# EAGLE design hybrid_esc (EAGLE 7.6.0)
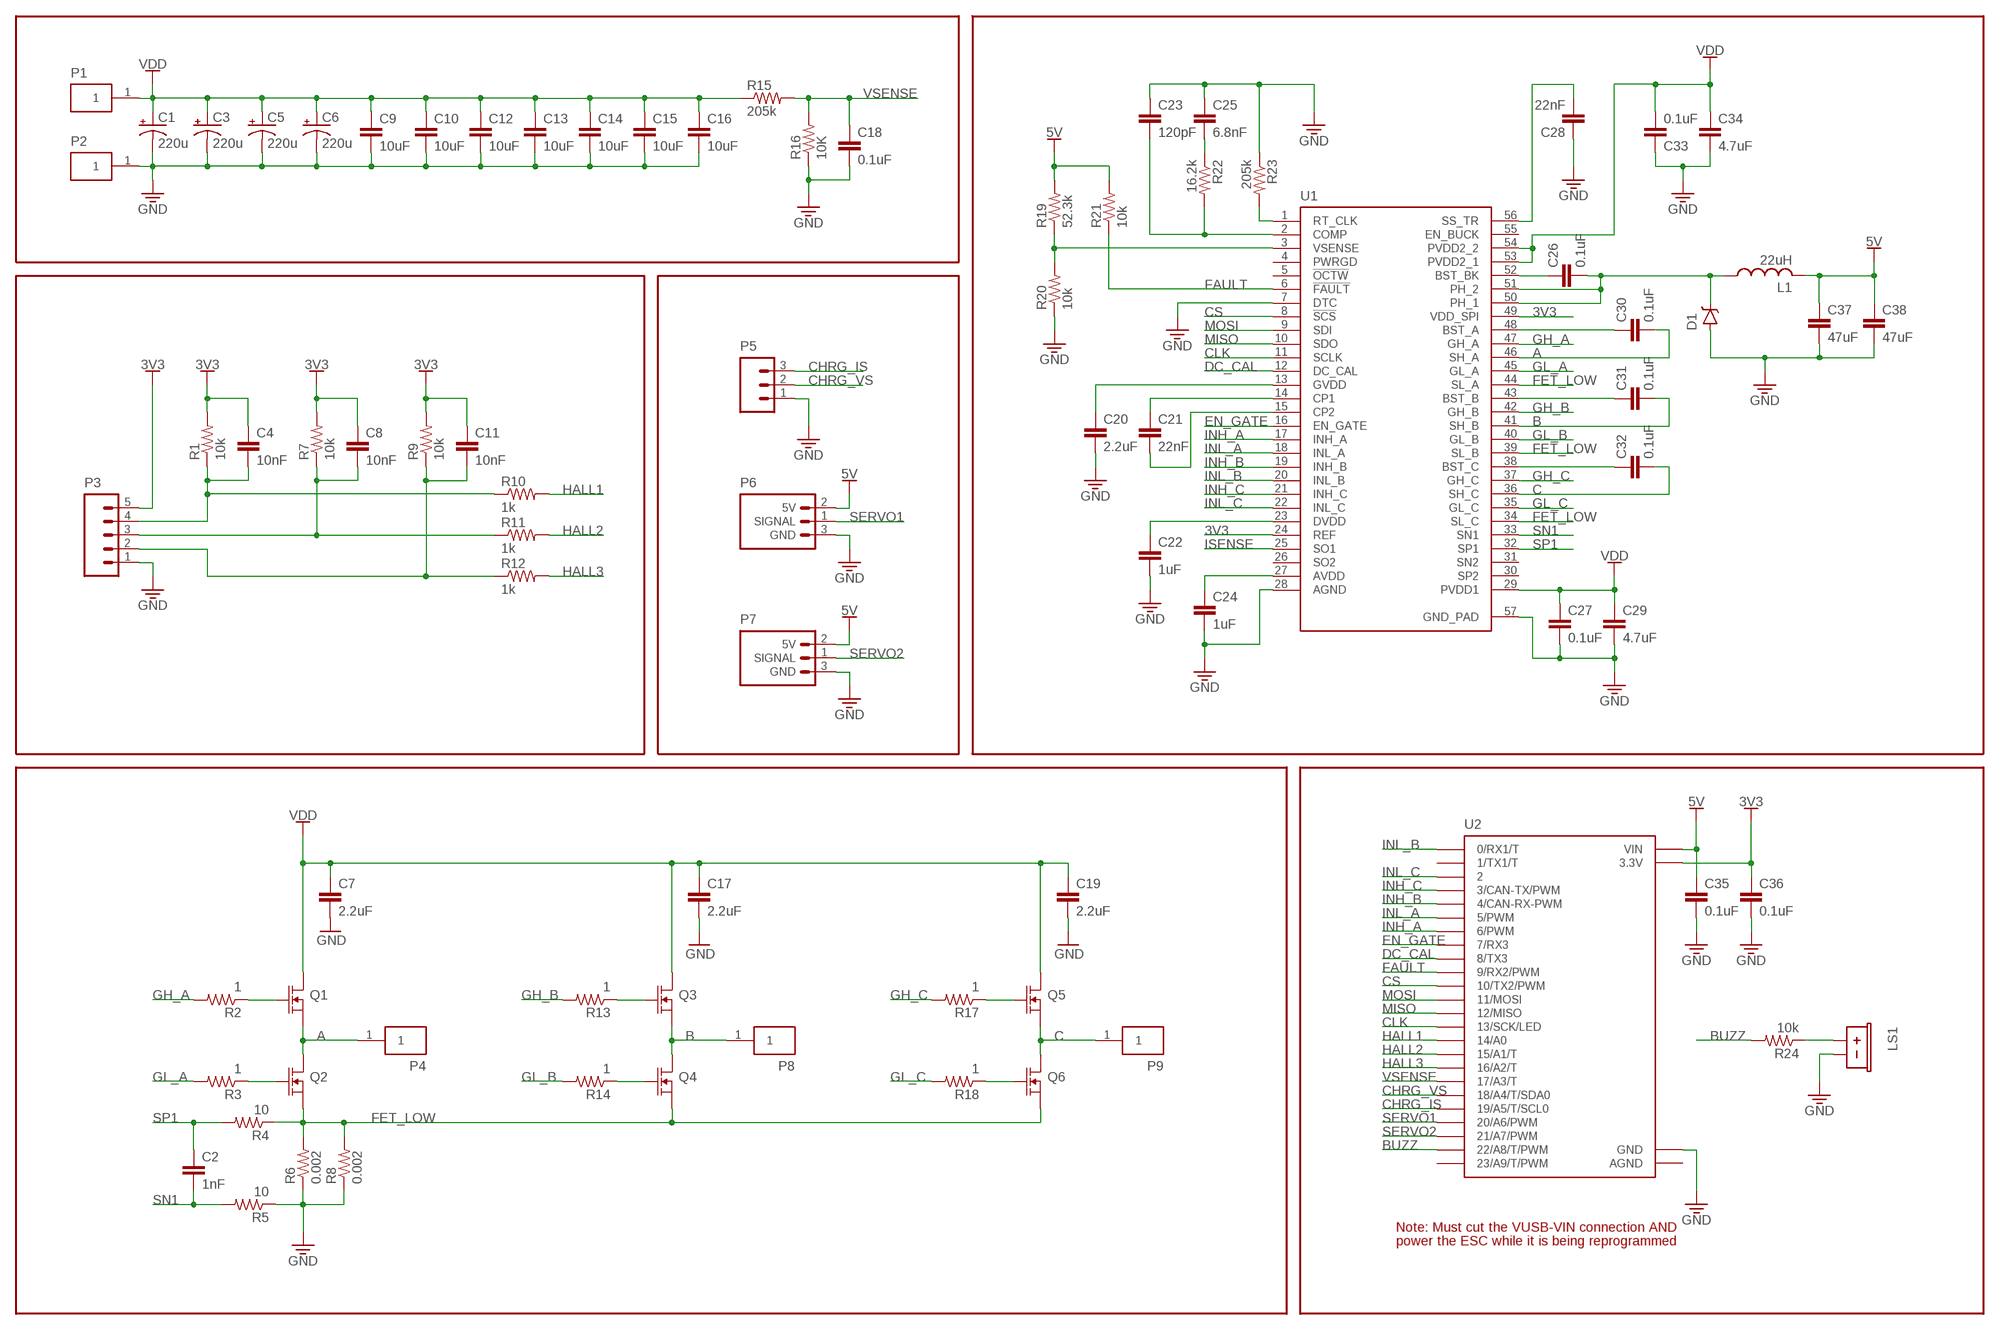
[diagram p0: schematic, sheet 1]

## Parts
C1  220u  CPOL_10_5  [CPOL_10_5]
C2  1nF  C0603  [C0603]
C3  220u  CPOL_10_5  [CPOL_10_5]
C4  10nF  C0603  [C0603]
C5  220u  CPOL_10_5  [CPOL_10_5]
C6  220u  CPOL_10_5  [CPOL_10_5]
C7  2.2uF  C1206  [C1206]
C8  10nF  C0603  [C0603]
C9  10uF  C1206  [C1206]
C10  10uF  C1206  [C1206]
C11  10nF  C0603  [C0603]
C12  10uF  C1206  [C1206]
C13  10uF  C1206  [C1206]
C14  10uF  C1206  [C1206]
C15  10uF  C1206  [C1206]
C16  10uF  C1206  [C1206]
C17  2.2uF  C1206  [C1206]
C18  0.1uF  C0603  [C0603]
C19  2.2uF  C1206  [C1206]
C20  2.2uF  C0603  [C0603]
C21  22nF  C0603  [C0603]
C22  1uF  C0603  [C0603]
C23  120pF  C0603  [C0603]
C24  1uF  C0603  [C0603]
C25  6.8nF  C0603  [C0603]
C26  0.1uF  C0603  [C0603]
C27  0.1uF  C0603  [C0603]
C28  22nF  C0603  [C0603]
C29  4.7uF  C1206  [C1206]
C30  0.1uF  C0603  [C0603]
C31  0.1uF  C0603  [C0603]
C32  0.1uF  C0603  [C0603]
C33  0.1uF  C0603  [C0603]
C34  4.7uF  C1206  [C1206]
C35  0.1uF  C0603  [C0603]
C36  0.1uF  C0603  [C0603]
C37  47uF  C1206  [C1206]
C38  47uF  C1206  [C1206]
D1  D_SOD123W  [SOD123W]
L1  22uH  L_SDR0805  [SDR0805]
LS1  BUZZER_12MM  [BUZZER_12MM]
P1  POWER_PAD  [POWER_PAD]
P2  POWER_PAD  [POWER_PAD]
P3  JST-XH5  [JST-XH5]
P4  POWER_PAD  [POWER_PAD]
P5  CONN_03  [CONN_03]
P6  SERVO  [SERVO]
P7  SERVO  [SERVO]
P8  POWER_PAD  [POWER_PAD]
P9  POWER_PAD  [POWER_PAD]
Q1  NFET_D2PAK-7  [D2PAK-7]
Q2  NFET_D2PAK-7  [D2PAK-7]
Q3  NFET_D2PAK-7  [D2PAK-7]
Q4  NFET_D2PAK-7  [D2PAK-7]
Q5  NFET_D2PAK-7  [D2PAK-7]
Q6  NFET_D2PAK-7  [D2PAK-7]
R1  10k  R0603  [R0603]
R2  1  R0603  [R0603]
R3  1  R0603  [R0603]
R4  10  R0603  [R0603]
R5  10  R0603  [R0603]
R6  0.002  R2512  [R2512]
R7  10k  R0603  [R0603]
R8  0.002  R2512  [R2512]
R9  10k  R0603  [R0603]
R10  1k  R0603  [R0603]
R11  1k  R0603  [R0603]
R12  1k  R0603  [R0603]
R13  1  R0603  [R0603]
R14  1  R0603  [R0603]
R15  205k  R0603  [R0603]
R16  10K  R0603  [R0603]
R17  1  R0603  [R0603]
R18  1  R0603  [R0603]
R19  52.3k  R0603  [R0603]
R20  10k  R0603  [R0603]
R21  10k  R0603  [R0603]
R22  16.2k  R0603  [R0603]
R23  205k  R0603  [R0603]
R24  10k  R0603  [R0603]
U1  DRV8301  [TSSOP56P]
U2  TEENSY_3.1  [TEENSY_3.1]

## Nets
3V3: C4.1 C8.1 C11.1 C36.1 P3.5 R1.2 R7.2 R9.2 U1.24(REF) U1.49(VDD_SPI) U2.3.3V
5V: C35.1 C37.1 C38.1 L1.2 P6.2(5V) P7.2(5V) R19.2 R21.2 U2.VIN
A: C30.2 P4.1 Q1.S Q1.S1(S) Q1.S2(S) Q1.S3(S) Q1.S4(S) Q2.D U1.46(SH_A)
B: C31.2 P8.1 Q3.S Q3.S1(S) Q3.S2(S) Q3.S3(S) Q3.S4(S) Q4.D U1.41(SH_B)
BUZZ: R24.2 U2.22/A8(22/A8/T/PWM)
C: C32.2 P9.1 Q5.S Q5.S1(S) Q5.S2(S) Q5.S3(S) Q5.S4(S) Q6.D U1.36(SH_C)
CHRG_IS: P5.3 U2.19/A5(19/A5/T/SCL0)
CHRG_VS: P5.2 U2.18/A4(18/A4/T/SDA0)
CLK: U1.11(SCLK) U2.13(13/SCK/LED)
CS: U1.8(!SCS) U2.10(10/TX2/PWM)
DC_CAL: U1.12(DC_CAL) U2.8(8/TX3)
EN_GATE: U1.16(EN_GATE) U2.7(7/RX3)
FAULT: R21.1 U1.6(!FAULT) U2.9(9/RX2/PWM)
FET_LOW: Q2.S Q2.S1(S) Q2.S2(S) Q2.S3(S) Q2.S4(S) Q4.S Q4.S1(S) Q4.S2(S) Q4.S3(S) Q4.S4(S) Q6.S Q6.S1(S) Q6.S2(S) Q6.S3(S) Q6.S4(S) R4.1 R6.2 R8.2 U1.34(SL_C) U1.39(SL_B) U1.44(SL_A)
GH_A: R2.2 U1.47(GH_A)
GH_B: R13.2 U1.42(GH_B)
GH_C: R17.2 U1.37(GH_C)
GL_A: R3.2 U1.45(GL_A)
GL_A': Q2.G R3.1
GL_B: R14.2 U1.40(GL_B)
GL_B': Q4.G R14.1
GL_C: R18.2 U1.35(GL_C)
GL_C': Q6.G R18.1
GND: C1.- C3.- C5.- C6.- C7.2 C9.2 C10.2 C12.2 C13.2 C14.2 C15.2 C16.2 C17.2 C18.2 C19.2 C20.2 C22.2 C23.1 C24.2 C25.1 C27.2 C28.1 C29.2 C33.1 C34.2 C35.2 C36.2 C37.2 C38.2 D1.A LS1.- P2.1 P3.1 P5.1 P6.3(GND) P7.3(GND) R5.1 R6.1 R8.1 R16.1 R20.1 R23.1 U1.7(DTC) U1.28(AGND) U1.57(GND_PAD) U2.GND
HALL1: R10.2 U2.14/A0
HALL2: R11.2 U2.15/A1(15/A1/T)
HALL3: R12.2 U2.16/A2(16/A2/T)
INH_A: U1.17(INH_A) U2.6(6/PWM)
INH_B: U1.19(INH_B) U2.4(4/CAN-RX-PWM)
INH_C: U1.21(INH_C) U2.3(3/CAN-TX/PWM)
INL_A: U1.18(INL_A) U2.5(5/PWM)
INL_B: U1.20(INL_B) U2.0(0/RX1/T)
INL_C: U1.22(INL_C) U2.2
ISENSE: U1.25(SO1)
MISO: U1.10(SDO) U2.12(12/MISO)
MOSI: U1.9(SDI) U2.11(11/MOSI)
N$1: Q3.G R13.1
N$2: R19.1 R20.2 U1.3(VSENSE)
N$3: C23.2 R22.2 U1.2(COMP)
N$4: C22.1 U1.23(DVDD)
N$5: Q5.G R17.1
N$6: C28.2 U1.56(SS_TR)
N$7: C25.2 R22.1
N$8: C26.1 U1.52(BST_BK)
N$9: Q1.G R2.1
N$10: R23.2 U1.1(RT_CLK)
N$13: C4.2 P3.4 R1.1 R10.1
N$18: LS1.+ R24.1
N$23: C8.2 P3.3 R7.1 R11.1
N$24: C11.2 P3.2 R9.1 R12.1
N$28: C32.1 U1.38(BST_C)
N$30: C21.1 U1.14(CP1)
N$31: C24.1 U1.27(AVDD)
N$32: C21.2 U1.15(CP2)
N$33: C20.1 U1.13(GVDD)
N$34: C31.1 U1.43(BST_B)
N$44: C30.1 U1.48(BST_A)
N$47: C26.2 D1.C L1.1 U1.50(PH_1) U1.51(PH_2)
SERVO1: P6.1(SIGNAL) U2.20/A6(20/A6/PWM)
SERVO2: P7.1(SIGNAL) U2.21/A7(21/A7/PWM)
SN1: C2.2 R5.2 U1.33(SN1)
SP1: C2.1 R4.2 U1.32(SP1)
VDD: C1.+ C3.+ C5.+ C6.+ C7.1 C9.1 C10.1 C12.1 C13.1 C14.1 C15.1 C16.1 C17.1 C19.1 C27.1 C29.1 C33.2 C34.1 P1.1 Q1.D Q3.D Q5.D R15.1 U1.29(PVDD1) U1.53(PVDD2_1) U1.54(PVDD2_2)
VSENSE: C18.1 R15.2 R16.2 U2.17/A3(17/A3/T)
Unconnected: U1.4(PWRGD) U1.5(!OCTW) U1.26(SO2) U1.30(SP2) U1.31(SN2) U1.55(EN_BUCK) U2.1(1/TX1/T) U2.23/A9(23/A9/T/PWM)

## Notes on the sheet
- Note: Must cut the VUSB-VIN connection AND
- power the ESC while it is being reprogrammed

## Power pins joined to a net without a drawn wire
AGND: U2.AGND

## Library data of the parts
C1 C3 C5 C6 = hybrid_esc:CPOL_10_5
C2 C4 C8 C11 C18 C20-C28 C30-C33 C35 C36 = hybrid_esc:C0603
C7 C9 C10 C12-C17 C19 C29 C34 C37 C38 = hybrid_esc:C1206
D1 = hybrid_esc:D_SOD123W
L1 = hybrid_esc:L_SDR0805
LS1 = hybrid_esc:BUZZER_12MM
P1 P2 P4 P8 P9 = hybrid_esc:POWER_PAD
P3 = hybrid_esc:JST-XH5
P5 = hybrid_esc:CONN_03
P6 P7 = hybrid_esc:SERVO
Q1-Q6 = hybrid_esc:NFET_D2PAK-7
R1-R5 R7 R9-R24 = hybrid_esc:R0603
R6 R8 = hybrid_esc:R2512
U1 = hybrid_esc:DRV8301
U2 = hybrid_esc:TEENSY_3.1

## Board
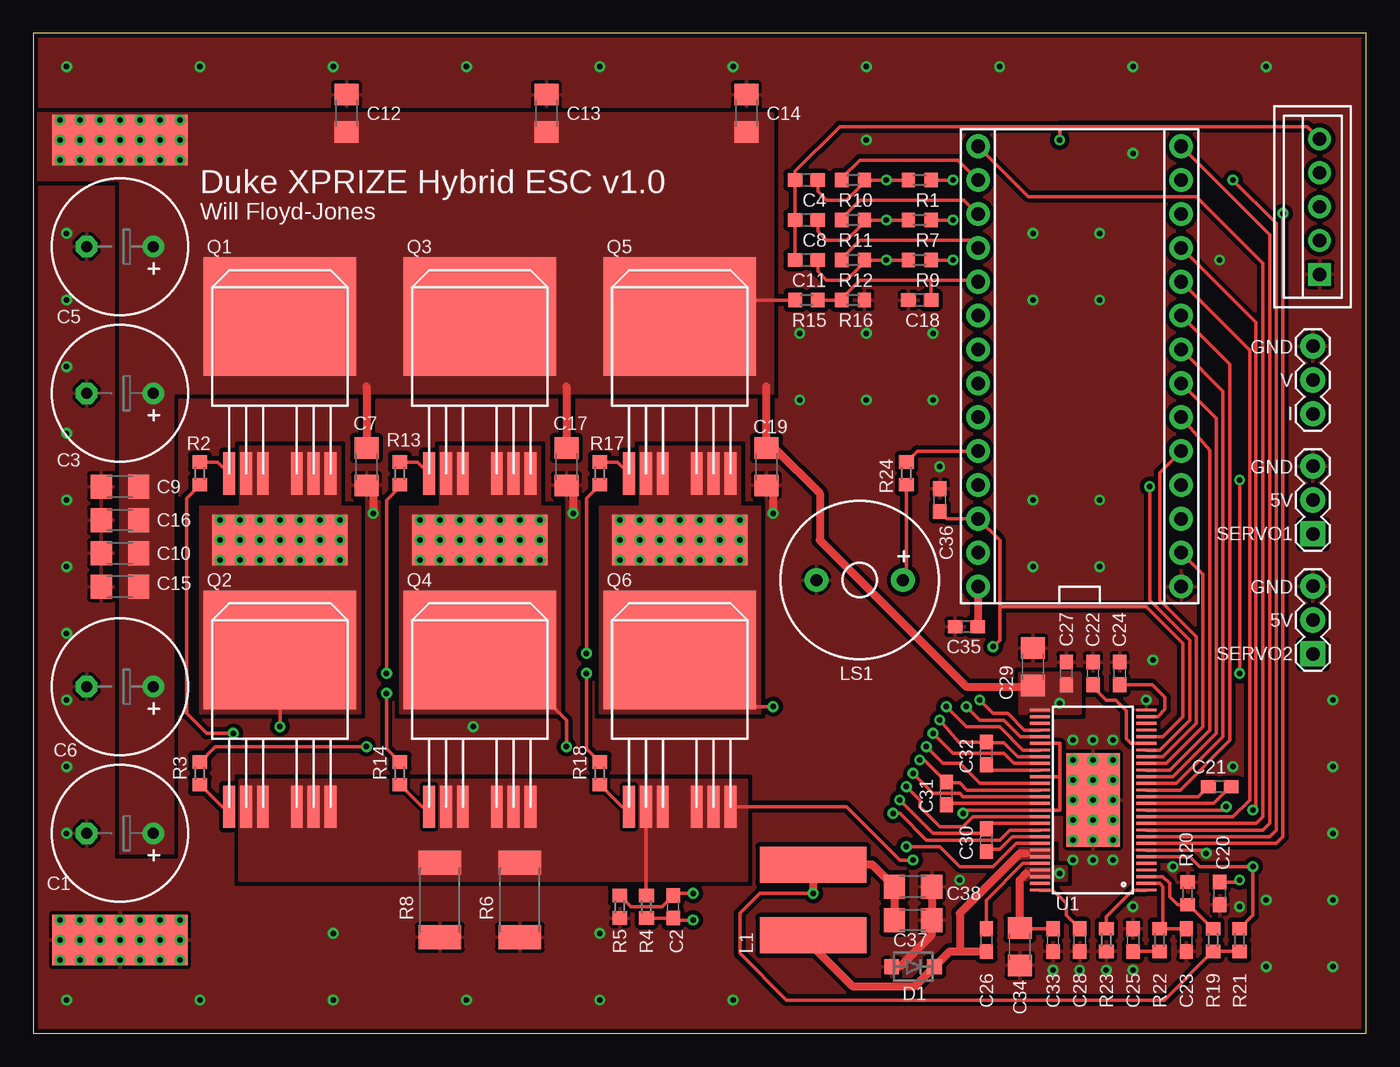
[diagram p1: board, top side]
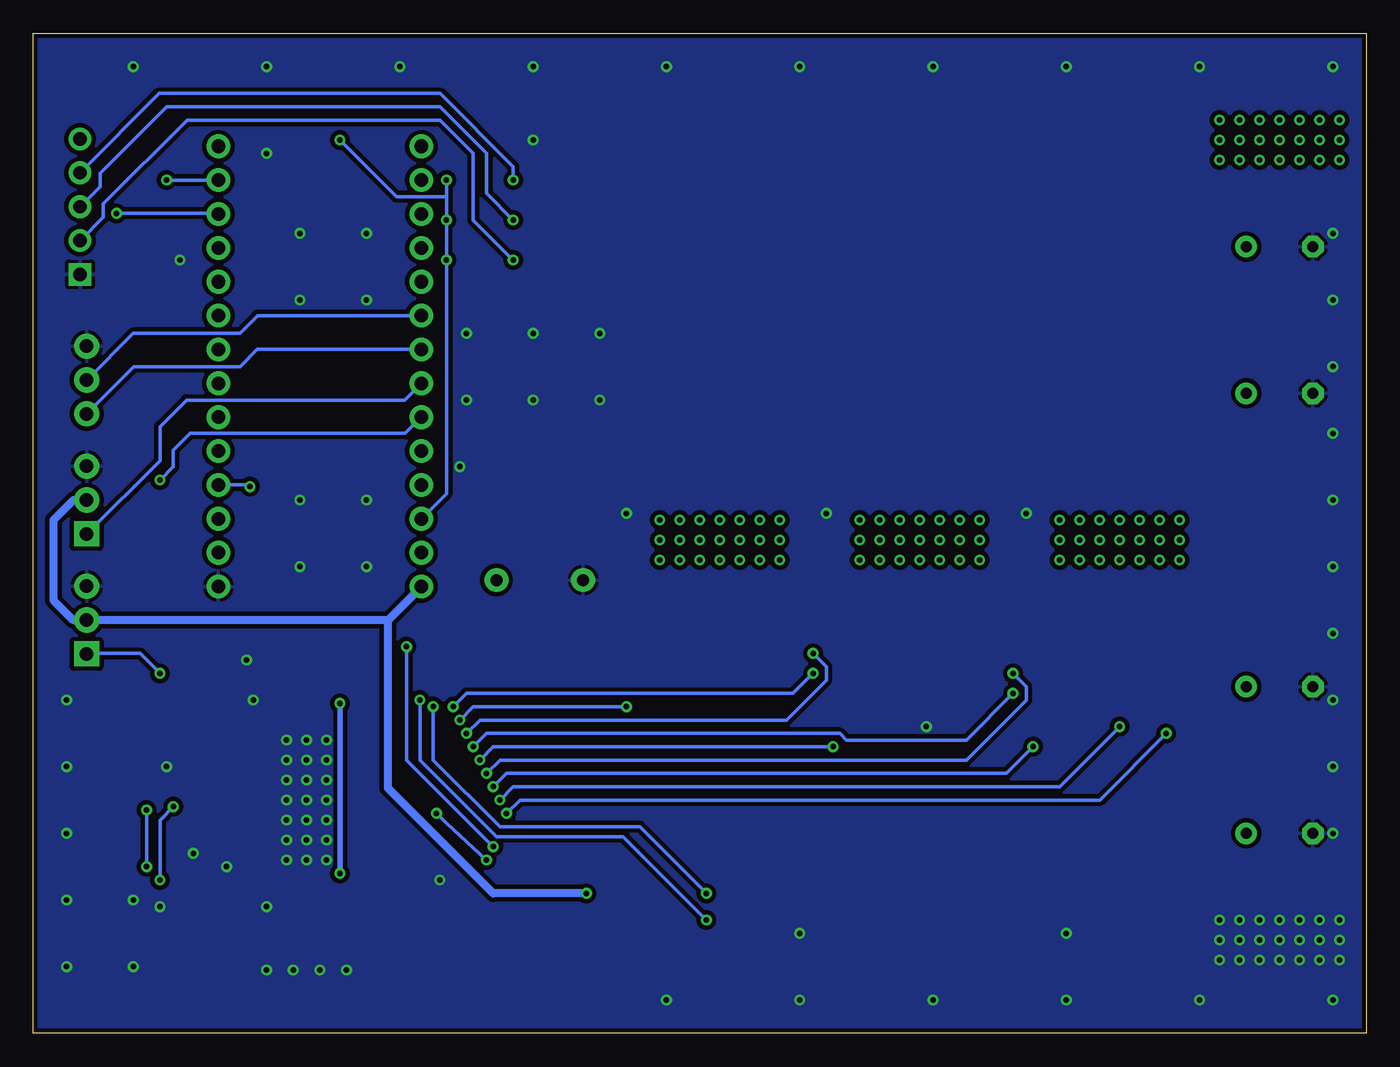
[diagram p2: board, bottom side, seen from below]

Size 100 x 75 mm. Coordinates in mm from the lower left corner, seen from the top.
Outline: 100,0 100,75 0,75 0,0 100,0
Copper layers (1*16): Top 0.035mm / dielectric 1.5mm / Bottom 0.035mm
Design rules "SeeedStudio": minimum track width 6mil, minimum drill 12mil, track to track 6mil, track to pad 6mil, pad to pad 6mil, via to via 6mil, smd to smd 0mil, copper to edge 10mil, drill to drill 10mil, minimum pad ring 10mil, minimum via ring 6mil, stop-mask expansion 2mil, vias tented up to drill 100mil, thermal gap 10mil

### Footprints (pad centres in the part's own frame; a part is rotated, then mirrored left to right if it is on the bottom)
CPOL_10_5 = drill 0.813 pad 1.6: + -2.5,0 | drill 0.813 pad 1.6 octagon: - 2.5,0
C0603 = smd 1.1 x 1: 1 -0.85,0; 2 0.85,0
C1206 = smd 1.6 x 1.8: 1 -1.4,0; 2 1.4,0
SOD123W = smd 1.1 x 1.1: A 1.6,0; C -1.6,0
SDR0805 = smd 2.7 x 8: 1 -2.65,0; 2 2.65,0
BUZZER_12MM = drill 0.9 pad 1.778: + 3.25,0; - -3.25,0
POWER_PAD = smd 10.16 x 3.81: 1 0,0
JST-XH5 = drill 1 pad 1.7 square: 1 -5.08,0 | drill 1 pad 1.7: 2 -2.54,0; 3 0,0; 4 2.54,0; 5 5.08,0
CONN_03 = drill 1.016 pad 1.88: 1 -2.54,0; 2 0,0; 3 2.54,0
SERVO = drill 1.016 pad 1.88 square: 1 -2.54,0 | drill 1.016 pad 1.88: 2 0,0; 3 2.54,0
D2PAK-7 = smd 11.43 x 8.89: D 0,11.748 | smd 0.889 x 3.175: G -3.81,0; S -2.54,0; S1 -1.27,0; S2 1.27,0; S3 2.54,0; S4 3.81,0
R0603 = smd 1 x 1.1: 1 -0.85,0; 2 0.85,0
R2512 = smd 1.8 x 3.2: 1 -2.8,0; 2 2.8,0
TSSOP56P = smd 1.5 x 0.21: 1 -4,6.75; 2 -4,6.25; 3 -4,5.75; 4 -4,5.25; 5 -4,4.75; 6 -4,4.25; 7 -4,3.75; 8 -4,3.25; 9 -4,2.75; 10 -4,2.25; 11 -4,1.75; 12 -4,1.25; 13 -4,0.75; 14 -4,0.25; 15 -4,-0.25; 16 -4,-0.75; 17 -4,-1.25; 18 -4,-1.75; 19 -4,-2.25; 20 -4,-2.75; 21 -4,-3.25; 22 -4,-3.75; 23 -4,-4.25; 24 -4,-4.75; 25 -4,-5.25; 26 -4,-5.75; 27 -4,-6.25; 28 -4,-6.75; 29 4,-6.75; 30 4,-6.25; 31 4,-5.75; 32 4,-5.25; 33 4,-4.75; 34 4,-4.25; 35 4,-3.75; 36 4,-3.25; 37 4,-2.75; 38 4,-2.25; 39 4,-1.75; 40 4,-1.25; 41 4,-0.75; 42 4,-0.25; 43 4,0.25; 44 4,0.75; 45 4,1.25; 46 4,1.75; 47 4,2.25; 48 4,2.75; 49 4,3.25; 50 4,3.75; 51 4,4.25; 52 4,4.75; 53 4,5.25; 54 4,5.75; 55 4,6.25; 56 4,6.75 | smd 4 x 7: 57 0,0
TEENSY_3.1 = drill 1.016 pad 1.778: 0 -7.62,12.7; 1 -7.62,10.16; 2 -7.62,7.62; 3 -7.62,5.08; 3.3V 7.62,10.16; 4 -7.62,2.54; 5 -7.62,0; 6 -7.62,-2.54; 7 -7.62,-5.08; 8 -7.62,-7.62; 9 -7.62,-10.16; 10 -7.62,-12.7; 11 -7.62,-15.24; 12 -7.62,-17.78; 13 7.62,-17.78; 14/A0 7.62,-15.24; 15/A1 7.62,-12.7; 16/A2 7.62,-10.16; 17/A3 7.62,-7.62; 18/A4 7.62,-5.08; 19/A5 7.62,-2.54; 20/A6 7.62,0; 21/A7 7.62,2.54; 22/A8 7.62,5.08; 23/A9 7.62,7.62; AGND 7.62,12.7; GND -7.62,15.24; VIN 7.62,15.24

### Placement (x,y rotation side)
C1  6.5,15 180 top
C2  48,9.5 90 top
C3  6.5,48 180 top
C4  58,64 0 top
C5  6.5,59 180 top
C6  6.5,26 180 top
C7  25,42.5 270 top
C8  58,61 0 top
C9  6.5,41 180 top
C10  6.5,36 180 top
C11  58,58 0 top
C12  23.5,69 90 top
C13  38.5,69 90 top
C14  53.5,69 90 top
C15  6.5,33.5 180 top
C16  6.5,38.5 180 top
C17  40,42.5 270 top
C18  66.5,55 180 top
C19  55,42.5 270 top
C20  89,10.5 270 top
C21  89,18.5 180 top
C22  79.5,27 90 top
C23  86.5,7 90 top
C24  81.5,27 90 top
C25  82.5,7 270 top
C26  71.5,7 270 top
C27  77.5,27 90 top
C28  78.5,7 90 top
C29  75,27.5 90 top
C30  71.5,14.5 90 top
C31  68.5,18 90 top
C32  71.5,21 90 top
C33  76.5,7 90 top
C34  74,6.5 270 top
C35  70,30.5 180 top
C36  68,40 90 top
C37  66,8.5 0 top
C38  66,11 0 top
D1  66,5 180 top
L1  58.5,10 90 top
LS1  62,34 0 top
P1  6.5,67 0 top
P2  6.5,7 0 top
P3  96.5,62 90 top
P4  18.5,37 0 top
P5  96,49 270 top
P6  96,40 90 top
P7  96,31 90 top
P8  33.5,37 0 top
P9  48.5,37 0 top
Q1  18.5,42 0 top
Q2  18.5,17 0 top
Q3  33.5,42 0 top
Q4  33.5,17 0 top
Q5  48.5,42 0 top
Q6  48.5,17 0 top
R1  66.5,64 0 top
R2  12.5,42 270 top
R3  12.5,19.5 90 top
R4  46,9.5 270 top
R5  44,9.5 90 top
R6  36.5,10 90 top
R7  66.5,61 0 top
R8  30.5,10 90 top
R9  66.5,58 0 top
R10  61.5,64 180 top
R11  61.5,61 180 top
R12  61.5,58 180 top
R13  27.5,42 270 top
R14  27.5,19.5 90 top
R15  58,55 0 top
R16  61.5,55 180 top
R17  42.5,42 270 top
R18  42.5,19.5 90 top
R19  88.5,7 270 top
R20  86.6,10.5 270 top
R21  90.5,7 270 top
R22  84.5,7 90 top
R23  80.5,7 90 top
R24  65.5,42 90 top
U1  79.5,17.5 180 top
U2  78.5,48.75 180 top

### Tracks (layer width: path | path; a pad name or v marks a point on that pad's centre or on a via)
3V3  (via drill 0.41 pad 0.81)
  Top 0.254: R9.2 v69,58 | R7.2 v69,61 | R1.2 v69,64 | v65.5,14 68,14 69.5,12.5 72,12.5 73.75,14.25 U1.49 | 77,68 95.58,68 P3.5 | 77,68 v77,67 | U1.24 84.75,22.25 86.25,23.75 86.25,29.25 83.5,32 72.5,32 | 72.5,32 72.5,36.97 U2.3.3V 68.56,38.59 C36.1 | 72.5,32 72.5,29.5 v72,29 | C11.1 C8.1 C4.1 57.15,64.65 60.5,68 77,68
  Bottom 0.254: 69,62.75 v69,61 v69,58 69,40.47 U2.3.3V | v72,29 72,20.5 v65.5,14 | v69,64 69,62.75 | 69,62.75 72.75,62.75 v77,67
5V  (via drill 0.41 pad 0.81)
  Top 0.254: C38.1 64.1,11.5 | R21.2 R19.2 84.85,2.5 56.5,2.5 53,6 53,9 54.5,10.5 v58.5,10.5
  Top 0.61: C37.1 C38.1 62.95,12.65 L1.2 v58.5,10.5 | U2.VIN 70.85,33.48 C35.1
  Bottom 0.61: U2.VIN 73.39,31 | 73.39,31 P7.2 97,31 98.5,32.5 98.5,38.5 97,40 P6.2 | v58.5,10.5 65.5,10.5 73.39,18.39 73.39,31
A  (via drill 0.41 pad 0.81)
  Top 0.254: U1.46 71.9,15.75 C30.2 71.15,15 67.5,15 v65,17.5 | Q2.D v18.5,23
  Bottom 0.254: v65,17.5 64,18.5 23,18.5 v18.5,23
  other vias: 18.5,38.5 18.5,37 18.5,35.5 20,35.5 20,37 20,38.5 21.5,38.5 23,38.5 23,37 21.5,37 21.5,35.5 23,35.5 17,38.5 17,37 17,35.5 15.5,35.5 15.5,37 15.5,38.5 14,38.5 14,37 14,35.5
  pour Top (no thermals): 12.5,24 12.5,39.5 15.5,39.5 15.5,44 23,44 23,39.5 24.5,39.5 24.5,24
B  (via drill 0.41 pad 0.81)
  Top 0.254: U1.41 70.05,18.25 69.5,18.8 68.55,18.8 C31.2 66.85,20.5 v66.5,20.5 | Q4.D 37.75,24.5 39,24.5 40,23.5 v40,21.5
  Bottom 0.254: v66.5,20.5 65.5,21.5 v40,21.5
  other vias: 33.5,37 33.5,38.5 33.5,35.5 35,35.5 35,37 35,38.5 36.5,38.5 36.5,37 36.5,35.5 38,35.5 38,37 38,38.5 32,35.5 30.5,35.5 29,35.5 29,37 30.5,37 29,38.5 30.5,38.5 32,38.5 32,37
  pour Top (no thermals): 27.5,24 27.5,39.5 30.5,39.5 30.5,44 38,44 38,39.5 39.5,39.5 39.5,24
BUZZ
  Top 0.254: R24.2 66.32,43.67 U2.22/A8
C  (via drill 0.41 pad 0.81)
  Top 0.254: v68,23.5 69.45,21.85 C32.2 71.55,21.8 72.8,21.8 73.85,20.75 U1.36 | v55.5,24.5 52.75,24.5 Q6.D
  Bottom 0.254: v55.5,24.5 67,24.5 v68,23.5
  other vias: 48.5,38.5 48.5,37 48.5,35.5 50,35.5 51.5,35.5 53,35.5 53,37 51.5,37 50,37 50,38.5 51.5,38.5 53,38.5 47,38.5 47,37 47,35.5 45.5,35.5 45.5,37 45.5,38.5 44,38.5 44,37 44,35.5
  pour Top (no thermals): 42.5,24 42.5,39.5 45.5,39.5 45.5,44 53,44 53,39.5 54.5,39.5 54.5,24
CHRG_IS
  Bottom 0.254: U2.19/A5 83.21,51.29 84.5,50 92.46,50 P5.3
CHRG_VS
  Bottom 0.254: U2.18/A4 83.17,53.83 84.5,52.5 92.5,52.5 P5.2
CLK
  Top 0.254: U1.11 91.75,15.75 92.25,16.25 92.25,57.75 87.25,62.75 74.66,62.75 U2.13
CS  (via drill 0.41 pad 0.81)
  Top 0.254: U1.8 93.25,14.25 93.75,14.75 v93.75,61.5
  Bottom 0.254: U2.10 86.17,61.5 v93.75,61.5
DC_CAL
  Top 0.254: U1.12 90,16.25 91.25,17.5 91.25,51.24 U2.8
EN_GATE
  Top 0.254: U1.16 86.05,18.25 89.75,22 89.75,50.2 U2.7
FAULT  (via drill 0.41 pad 0.81)
  Top 0.254: v91.5,16.75 91.7,17.1 91.7,53.33 U2.9 | U1.6 86.75,13.25 87.5,12.5 v91.5,12.5 91.5,8.85 R21.1
  Bottom 0.254: v91.5,12.5 v91.5,16.75
FET_LOW  (via drill 0.41 pad 0.81)
  Top 0.254: 77,19.25 77,21.75 U1.34 | 77,19.25 77,16.75 U1.44 70,16.75 v69.75,16.5 | v66,13 65,13 61,17 Q6.S4 | U1.39 77,19.25 | R4.1 45.96,10.39 Q6.S
  Bottom 0.254: v66,13 69,15.75 v69.75,16.5
  pour Top (isolate 0.254, no thermals): 15.5,11.5 15.5,19 53.5,19 53.5,11.5
GH_A  (via drill 0.41 pad 0.81)
  Top 0.254: v15,22.5 13,22.5 11.5,24 11.5,40.15 R2.2 | U1.47 73.25,15.25 72.5,14.5 67,14.5 65,16.5 v64.5,16.5
  Bottom 0.254: v15,22.5 20,17.5 63.5,17.5 v64.5,16.5
GH_B  (via drill 0.41 pad 0.81)
  Top 0.254: U1.42 69.75,17.75 69.5,18 67.5,18 v66,19.5 | R13.2 27.5,41 26.5,40 v26.5,27
  Bottom 0.254: v26.5,27 25.5,26 25.5,25 30,20.5 65,20.5 v66,19.5
GH_C  (via drill 0.41 pad 0.81)
  Top 0.254: v67.5,22.5 69,21 72.8,21 73.55,20.25 U1.37 | R17.2 41.5,40.15 v41.5,28.5
  Bottom 0.254: v41.5,28.5 40.5,27.5 40.5,26.5 43.5,23.5 66.5,23.5 v67.5,22.5
GL_A  (via drill 0.41 pad 0.81)
  Top 0.254: v25,21.5 13.65,21.5 R3.2 | U1.45 70.5,16.25 69.75,15.5 68,15.5 66.5,17 66.5,17.5 v65.5,18.5
  Bottom 0.254: v25,21.5 27,19.5 64.5,19.5 v65.5,18.5
GL_A'
  Top 0.254: Q2.G 14.15,17 R3.1
GL_B  (via drill 0.41 pad 0.81)
  Top 0.254: U1.40 71,18.75 69.5,20.25 68.25,20.25 v67,21.5 | R14.2 26.5,21.35 v26.5,25.5
  Bottom 0.254: v67,21.5 66,22.5 39.5,22.5 39,22 30,22 v26.5,25.5
GL_B'
  Top 0.254: Q4.G 29.15,17 R14.1
GL_C  (via drill 0.41 pad 0.81)
  Top 0.254: U1.35 74.25,21.25 72.5,23 70,23 v68.5,24.5 | v41.5,27 41.5,21.35 R18.2
  Bottom 0.254: v68.5,24.5 67.5,25.5 43,25.5 v41.5,27
GL_C'
  Top 0.254: Q6.G 44.15,17 R18.1
GND  (via drill 0.41 pad 0.81)
  Top 0.254: U1.7 87.75,13.75 v88,13.5
  Top 0.61: C38.2 C37.2 67.4,7.4 65,5 D1.A | C7.2 25.5,40.6 v25.5,39 | C17.2 40.5,40.6 v40.5,39 | C19.2 55.5,40.6 v55.5,39
  other vias: 83.5,25 78,14.5 81,14.5 81,16 78,16 78,17.5 78,19 81,17.5 81,19 81,20.5 78,20.5 82.5,9.5 6.5,8.5 5,8.5 3.5,8.5 2,8.5 2,7 2,5.5 3.5,5.5 3.5,7 5,7 5,5.5 6.5,5.5 6.5,7 8,5.5 8,7 8,8.5 9.5,8.5 11,8.5 11,7 9.5,7 9.5,5.5 11,5.5 90.5,9.5 85.5,12.5 79.5,20.5 79.5,19 79.5,17.5 79.5,16 78,13 79.5,13 81,13 81,22 79.5,22 78,22 84,28 68,42.5 75,35 75,60 89,58 33,23 90,20 75,40 80,40 80,35 80,55 80,60 75,55 22.5,7.5 42.5,7.5 62.5,47.5 22.5,2.5 32.5,2.5 42.5,2.5 52.5,2.5 12.5,2.5 2.5,2.5 92.5,5 97.5,5 92.5,10 97.5,10 97.5,15 97.5,20 97.5,25 2.5,15 2.5,20 2.5,25 2.5,30 2.5,35 2.5,40 2.5,45 2.5,50 2.5,55 2.5,60 62.5,52.5 57.5,47.5 57.5,52.5 67.5,52.5 67.5,47.5 78.5,4.75 76.5,4.75 80.5,4.75 82.5,4.75 69.5,11.5 2.5,72.5 12.5,72.5 22.5,72.5 32.5,72.5 42.5,72.5 52.5,72.5 62.5,72.5 72.5,72.5 82.5,72.5 92.5,72.5 62.5,67 82.5,66 79.5,14.5
  pour Top (isolate 0.33, rank 2): -10,85 -10,-10 110,-10 110,85
  pour Bottom (isolate 0.33, rank 2): -5,80 -5,-5 105,-5 105,80
HALL1
  Top 0.254: U2.14/A0 69.37,65.5 62,65.5 60.65,64.15 R10.2
HALL2
  Top 0.254: U2.15/A1 69.83,62.5 62,62.5 60.65,61.15 R11.2
HALL3
  Top 0.254: U2.16/A2 70.29,59.5 62,59.5 60.65,58.15 R12.2
INH_A
  Top 0.254: U1.17 85.75,18.75 89.25,22.25 89.25,48.16 U2.6
INH_B
  Top 0.254: U1.19 85.25,19.75 88.25,22.75 88.25,43.75 U2.4
INH_C
  Top 0.254: U1.21 84.75,20.75 87.25,23.25 87.25,29.75 84.5,32.5 84.5,42.05 U2.3
INL_A
  Top 0.254: U1.18 85.5,19.25 88.75,22.5 88.75,46.12 U2.5
INL_B
  Top 0.254: U1.20 85,20.25 87.75,23 87.75,34.42 U2.0
INL_C  (via drill 0.41 pad 0.81)
  Top 0.254: U1.22 84.5,21.25 86.75,23.5 86.75,29.5 83.75,32.5 v83.75,41
  Bottom 0.254: U2.2 83.88,41.13 v83.75,41
MISO
  Top 0.254: U1.10 92.25,15.25 92.75,15.75 92.75,59.9 U2.12
MOSI  (via drill 0.41 pad 0.81)
  Top 0.254: U1.9 92.75,14.75 93.25,15.25 93.25,60.75 v90,64
  Bottom 0.254: U2.11 v90,64
N$1
  Top 0.254: Q3.G 28.84,42.85 R13.1
N$2
  Top 0.254: U1.3 84.75,11.75 85.25,11.25 85.25,10.25 85.85,9.65 R20.2 86.7,9.65 R19.1
N$3
  Top 0.254: C23.2 R22.2 84.75,8.1 84.75,11 84.5,11.25 U1.2
N$4
  Top 0.254: C22.1 79.5,26 80.5,25 81.2,25 82,24.2 82,22.1 82.35,21.75 U1.23
N$5
  Top 0.254: Q5.G 43.84,42.85 R17.1
N$6
  Top 0.254: U1.56 76.5,10.75 77.5,9.75 77.5,8.85 C28.2
N$7
  Top 0.254: R22.1 C25.2
N$8
  Top 0.254: U1.52 74.25,12.75 71.5,10 C26.1
N$9
  Top 0.254: Q1.G 13.84,42.85 R2.1
N$10
  Top 0.254: U1.1 82.5,10.75 80.5,8.75 R23.2
N$13  (via drill 0.41 pad 0.81)
  Top 0.254: R1.1 v64,64 R10.1 62.35,63.85 61,62.5 59.5,62.5 58.85,63.15 C4.2
  Bottom 0.254: v64,64 64,65 69.5,70.5 90.54,70.5 P3.4
N$18
  Top 0.254: LS1.+ 65.5,34.25 R24.1
N$23  (via drill 0.41 pad 0.81)
  Top 0.254: R7.1 v64,61 R11.1 62.35,60.85 61,59.5 59.5,59.5 58.85,60.15 C8.2
  Bottom 0.254: v64,61 66,63 66,66 69.5,69.5 90,69.5 95,64.5 95,63.5 P3.3
N$24  (via drill 0.41 pad 0.81)
  Top 0.254: R9.1 v64,58 R12.1 62.35,57.85 61,56.5 59.5,56.5 58.85,57.15 C11.2
  Bottom 0.254: v64,58 67,61 67,66 69.5,68.5 88.46,68.5 94.75,62.21 94.75,61.21 P3.2
N$28
  Top 0.254: 71.87,19.78 C32.1 71.9,19.75 U1.38
N$30
  Top 0.152: 89.5,18.2 89.5,18.25 C21.1
  Top 0.254: 89.5,18.2 89.55,18.2 | U1.14 88.55,17.25 89.5,18.2 | 89.5,18.2 89.8,18.5 C21.1
N$31
  Top 0.254: C24.1 83.95,26.15 84.9,25.2 84.9,24.3 84.35,23.75 U1.27
N$32
  Top 0.254: U1.15 87.4,17.75 C21.2
N$33  (via drill 0.41 pad 0.81)
  Top 0.254: U1.13 89.25,16.75 v89.5,17 | v90.5,11.5 90.35,11.35 C20.1
  Bottom 0.254: v90.5,11.5 90.5,16 v89.5,17
N$34
  Top 0.254: 68.63,17.28 C31.1 68.6,17.25 U1.43
N$44
  Top 0.254: C30.1 71.65,13.8 72.5,13.8 73.45,14.75 U1.48
N$47
  Top 0.61: 69.5,6.15 68.75,6.15 D1.C 66.1,3.5 61.5,3.5 58.5,6.5 L1.1 | 69.5,6.15 C26.2 | 69.5,6.15 69.5,9 74,13.5 74.5,13.5
  pour Top (no thermals): 74,14 76.5,14 76.5,13 74,13
SERVO1
  Bottom 0.254: U2.20/A6 72.13,47.5 88.5,47.5 90.5,45.5 90.5,42.96 P6.1
SERVO2  (via drill 0.41 pad 0.81)
  Top 0.254: v90.5,27 v90.5,41.5
  Bottom 0.254: U2.21/A7 72.09,45 88.25,45 89.5,43.75 89.5,42.5 v90.5,41.5 | P7.1 95.96,28.5 92,28.5 v90.5,27
SN1  (via drill 0.41 pad 0.81)
  Top 0.254: R5.2 44.85,9.5 47.15,9.5 C2.2 48.15,10.5 v49.5,10.5 | U1.33 74.05,22.25 72.8,23.5 71,23.5 v70,24.5
  Bottom 0.254: v70,24.5 70,20.5 65,15.5 54.5,15.5 v49.5,10.5
SP1  (via drill 0.41 pad 0.81)
  Top 0.254: R4.2 C2.1 48.15,8.5 v49.5,8.5 | U1.32 74.35,22.75 73.1,24 72,24 v71,25
  Bottom 0.254: v71,25 71,20.5 65.25,14.75 55.75,14.75 v49.5,8.5
VDD  (via drill 0.41 pad 0.81)
  Top 0.254: C34.1 74.55,7.85 C33.2 | R15.1 49.75,55 48.88,54.12 Q5.D
  Top 0.61: 25,48.5 C7.1 | 40,48.5 C17.1 | 55,48.5 C19.1 55.6,43.9 59,40.5 59,37 70,26 74.9,26 C29.1 | 48.88,53.62 48.88,54.12 | 49.75,53.75 Q5.D | 19.75,53.75 Q1.D | 74.55,7.85 74,8.4 74,11.5 74.5,12
  Bottom 0.406: v77,24.75 v77,12
  other vias: 2,68.5 2,67 2,65.5 3.5,65.5 3.5,67 3.5,68.5 5,68.5 5,67 5,65.5 6.5,65.5 6.5,67 6.5,68.5 8,68.5 8,67 8,65.5 9.5,65.5 9.5,67 9.5,68.5 11,68.5 11,67 11,65.5
  pour Top (no thermals): 55.5,69 0,69 0,64 6.5,64 6.5,13.5 10.5,13.5 10.5,48 55.5,48
  pour Top (no thermals): 74.5,12.5 77.5,12.5 77.5,11.5 74.5,11.5
  pour Top (no thermals): 74,24 74,27 78.5,27 78.5,24
VSENSE
  Top 0.254: R15.2 R16.2 60.65,55.15 62,56.5 67.35,56.5 | 67.35,56.5 70.75,56.5 U2.17/A3 | C18.1 67.35,56.5

### Text on the board
tPlace: Duke XPRIZE Hybrid ESC v1.0 | Will Floyd-Jones | GND | V | I | GND | 5V | SERVO1 | GND | 5V | SERVO2